# Altium schematic sheet 4-POWER.SchDoc
size A3
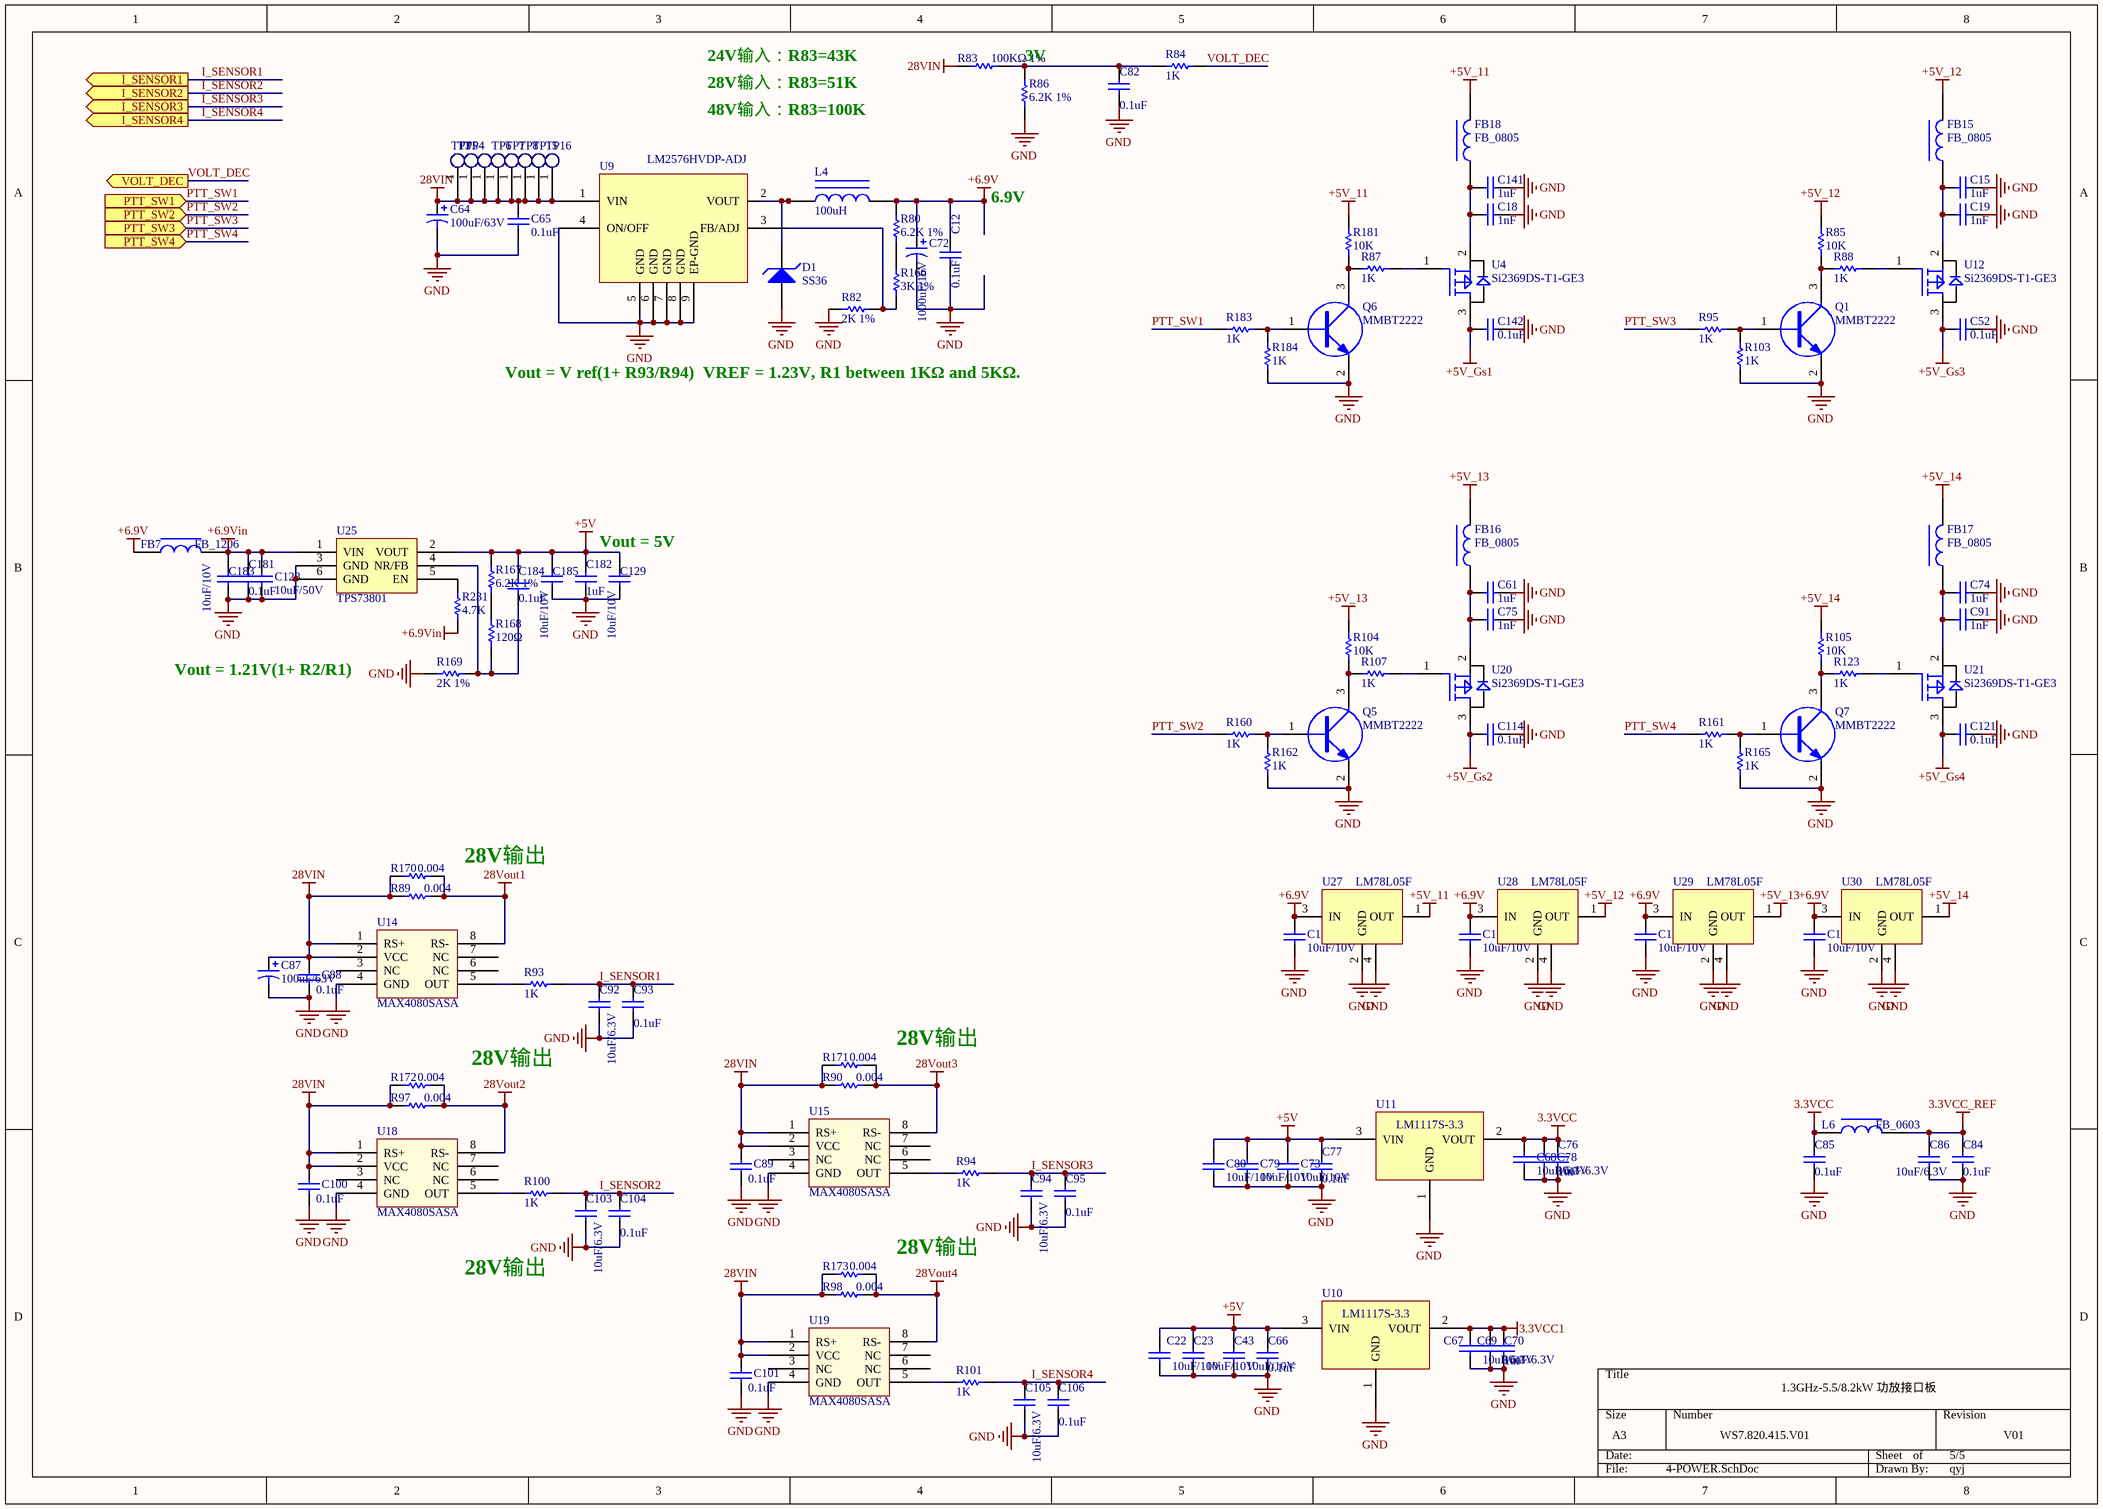
[diagram p0: 4-POWER.SchDoc]

## Parts
C12  0.1uF  [C0603]
C15  1uF  [C0603]
C18  1nF  [C0603]
C19  1nF  [C0603]
C22  10uF/10V  [C0805]
C23  10uF/10V  [C0805]
C43  10uF/10V  [C0805]
C52  0.1uF  [C0603]
C61  1uF  [C0603]
C64  100uF/63V  [ECAP2SM_10R4x10R4]
C65  0.1uF  [C0603]
C66  0.1uF  [C0603]
C67  10uF/6.3V  [C0603]
C68  10uF/6.3V  [C0603]
C69  10uF/6.3V  [C0603]
C70  1uF  [C0603]
C72  1000uF/16V  [ECAP2SM_10R4x10R4]
C73  10uF/10V  [C0805]
C74  1uF  [C0603]
C75  1nF  [C0603]
C76  1uF  [C0603]
C77  0.1uF  [C0603]
C78  10uF/6.3V  [C0603]
C79  10uF/10V  [C0805]
C80  10uF/10V  [C0805]
C82  0.1uF  [C0603]
C84  0.1uF  [C0603]
C85  0.1uF  [C0603]
C86  10uF/6.3V  [C0603]
C87  100uF/63V  [ECAP2SM_10R4x10R4]
C88  0.1uF  [C0603]
C89  0.1uF  [C0603]
C91  1nF  [C0603]
C92  10uF/6.3V  [C0603]
C93  0.1uF  [C0603]
C94  10uF/6.3V  [C0603]
C95  0.1uF  [C0603]
C100  0.1uF  [C0603]
C101  0.1uF  [C0603]
C103  10uF/6.3V  [C0603]
C104  0.1uF  [C0603]
C105  10uF/6.3V  [C0603]
C106  0.1uF  [C0603]
C114  0.1uF  [C0603]
C121  0.1uF  [C0603]
C128  10uF/50V  [C1210]
C129  10uF/10V  [C0805]
C132  10uF/10V  [C0805]
C133  10uF/10V  [C0805]
C134  10uF/10V  [C0805]
C135  10uF/10V  [C0805]
C141  1uF  [C0603]
C142  0.1uF  [C0603]
C181  0.1uF  [C0603]
C182  1uF  [C0603]
C183  10uF/10V  [C0805]
C184  0.1uF  [C0603]
C185  10uF/10V  [C0805]
D1  SS36  [DO-214AC]
FB7  FB_1206  [L1206]
FB15  FB_0805  [L0805]
FB16  FB_0805  [L0805]
FB17  FB_0805  [L0805]
FB18  FB_0805  [L0805]
L4  100uH  [PL2SM-12R5x12R5]
L6  FB_0603  [L0603]
Q1  MMBT2222  [SOT23-3]
Q5  MMBT2222  [SOT23-3]
Q6  MMBT2222  [SOT23-3]
Q7  MMBT2222  [SOT23-3]
R80  6.2K 1%  [R0603]
R82  2K 1%  [R0603]
R83  100KΩ 1%  [R0603]
R84  1K  [R0603]
R85  10K  [R0603]
R86  6.2K 1%  [R0603]
R87  1K  [R0603]
R88  1K  [R0603]
R89  0.004  [R2512]
R90  0.004  [R2512]
R93  1K  [R0603]
R94  1K  [R0603]
R95  1K  [R0603]
R97  0.004  [R2512]
R98  0.004  [R2512]
R100  1K  [R0603]
R101  1K  [R0603]
R103  1K  [R0603]
R104  10K  [R0603]
R105  10K  [R0603]
R107  1K  [R0603]
R123  1K  [R0603]
R160  1K  [R0603]
R161  1K  [R0603]
R162  1K  [R0603]
R165  1K  [R0603]
R166  3K 1%  [R0603]
R167  6.2K 1%  [R0603]
R168  120Ω  [R0603]
R169  2K 1%  [R0603]
R170  0.004  [R2512]
R171  0.004  [R2512]
R172  0.004  [R2512]
R173  0.004  [R2512]
R181  10K  [R0603]
R183  1K  [R0603]
R184  1K  [R0603]
R231  4.7K  [R0603]
TP3  RTF-76-006-M4-S  [FC-M4]  (value not drawn)  (no BOM)
TP4  RTF-76-006-M4-S  [FC-M4]  (value not drawn)  (no BOM)
TP5  RTF-76-006-M4-S  [FC-M4]  (value not drawn)  (no BOM)
TP6  RTF-76-006-M4-S  [FC-M4]  (value not drawn)  (no BOM)
TP7  RTF-76-006-M4-S  [FC-M4]  (value not drawn)  (no BOM)
TP8  RTF-76-006-M4-S  [FC-M4]  (value not drawn)  (no BOM)
TP15  RTF-76-006-M4-S  [FC-M4]  (value not drawn)  (no BOM)
TP16  RTF-76-006-M4-S  [FC-M4]  (value not drawn)  (no BOM)
U4  Si2369DS-T1-GE3  [SOT23-3]
U9  LM2576HVDP-ADJ  [SOIC8_1R27_3R9x4R9-1]
U10  LM1117S-3.3  [SOT-223]
U11  LM1117S-3.3  [SOT-223]
U12  Si2369DS-T1-GE3  [SOT23-3]
U14  MAX4080SASA  [SOIC8_1R27_3R9x4R9]
U15  MAX4080SASA  [SOIC8_1R27_3R9x4R9]
U18  MAX4080SASA  [SOIC8_1R27_3R9x4R9]
U19  MAX4080SASA  [SOIC8_1R27_3R9x4R9]
U20  Si2369DS-T1-GE3  [SOT23-3]
U21  Si2369DS-T1-GE3  [SOT23-3]
U25  TPS73801  [SOT-223-6]
U27  LM78L05F  [SOT-89]
U28  LM78L05F  [SOT-89]
U29  LM78L05F  [SOT-89]
U30  LM78L05F  [SOT-89]

## Ports
I_SENSOR1 (out), I_SENSOR2 (out), I_SENSOR3 (out), I_SENSOR4 (out), PTT_SW1 (in), PTT_SW2 (in), PTT_SW3 (in), PTT_SW4 (in), VOLT_DEC (out)

## Nets
3.3VCC: C68.2 C76.2 C78.2 C85.2 L6.1 U11.2(VOUT)
3.3VCC1: C67.2 C69.2 C70.2 U10.2(VOUT)
3.3VCC_REF: C84.2 C86.2 L6.2
28VIN: C64.1 C65.2 C87.1 C88.2 C89.2 C100.2 C101.2 R83.1 R89.1 R90.1 R97.1 R98.1 R170.1 R171.1 R172.1 R173.1 TP3.1(TP) TP4.1(TP) TP5.1(TP) TP6.1(TP) TP7.1(TP) TP8.1(TP) TP15.1(TP) TP16.1(TP) U9.1(VIN) U14.1(RS+) U14.2(VCC) U15.1(RS+) U15.2(VCC) U18.1(RS+) U18.2(VCC) U19.1(RS+) U19.2(VCC)
28Vout1: R89.2 R170.2 U14.8(RS-)
28Vout2: R97.2 R172.2 U18.8(RS-)
28Vout3: R90.2 R171.2 U15.8(RS-)
28Vout4: R98.2 R173.2 U19.8(RS-)
+5V: C22.2 C23.2 C43.2 C66.2 C73.2 C77.2 C79.2 C80.2 C129.2 C182.2 C184.2 C185.2 R167.2 U10.3(VIN) U11.3(VIN) U25.2(VOUT)
+5V_11: FB18.2 R181.2 U27.1(OUT)
+5V_12: FB15.2 R85.2 U28.1(OUT)
+5V_13: FB16.2 R104.2 U29.1(OUT)
+5V_14: FB17.2 R105.2 U30.1(OUT)
+5V_Gs1: C142.2 U4.3(D)
+5V_Gs2: C114.2 U20.3(D)
+5V_Gs3: C52.2 U12.3(D)
+5V_Gs4: C121.2 U21.3(D)
+6.9V: C12.2 C72.1 C132.2 C133.2 C134.2 C135.2 FB7.1 L4.2 R80.2 U27.3(IN) U28.3(IN) U29.3(IN) U30.3(IN)
+6.9Vin: C128.2 C181.2 C183.2 FB7.2 R231.2 U25.1(VIN)
GND: C12.1 C15.1 C18.2 C19.2 C22.1 C23.1 C43.1 C52.1 C61.1 C64.2 C65.1 C66.1 C67.1 C68.1 C69.1 C70.1 C72.2 C73.1 C74.1 C75.2 C76.1 C77.1 C78.1 C79.1 C80.1 C82.1 C84.1 C85.1 C86.1 C87.2 C88.1 C89.1 C91.2 C92.1 C93.1 C94.1 C95.1 C100.1 C101.1 C103.1 C104.1 C105.1 C106.1 C114.1 C121.1 C128.1 C129.1 C132.1 C133.1 C134.1 C135.1 C141.1 C142.1 C181.1 C182.1 C183.1 C185.1 D1.1(A) Q1.2(E) Q5.2(E) Q6.2(E) Q7.2(E) R82.2 R86.1 R103.1 R162.1 R165.1 R169.2 R184.1 U9.4(ON/OFF) U9.5(GND) U9.6(GND) U9.7(GND) U9.8(GND) U9.9(EP-GND) U10.1(GND) U11.1(GND) U14.4(GND) U15.4(GND) U18.4(GND) U19.4(GND) U25.3(GND) U25.6(GND) U27.2(GND) U27.4(GND) U28.2(GND) U28.4(GND) U29.2(GND) U29.4(GND) U30.2(GND) U30.4(GND)
I_SENSOR1: C92.2 C93.2 R93.2 ; port I_SENSOR1
I_SENSOR2: C103.2 C104.2 R100.2 ; port I_SENSOR2
I_SENSOR3: C94.2 C95.2 R94.2 ; port I_SENSOR3
I_SENSOR4: C105.2 C106.2 R101.2 ; port I_SENSOR4
PTT_SW1: R183.1 ; port PTT_SW1
PTT_SW2: R160.1 ; port PTT_SW2
PTT_SW3: R95.1 ; port PTT_SW3
PTT_SW4: R161.1 ; port PTT_SW4
VOLT_DEC: R84.1 ; port VOLT_DEC
NetC15_2: C15.2 C19.1 FB15.1 U12.2(S)
NetC18_1: C18.1 C141.2 FB18.1 U4.2(S)
NetC61_2: C61.2 C75.1 FB16.1 U20.2(S)
NetC74_2: C74.2 C91.1 FB17.1 U21.2(S)
NetC82_2: C82.2 R83.2 R84.2 R86.2
NetC184_1: C184.1 R168.1 R169.1 U25.4(NR/FB)
NetD1_2: D1.2(K) L4.1 U9.2(VOUT)
NetQ1_1: Q1.1(B) R95.2 R103.2
NetQ1_3: Q1.3(C) R85.1 R88.1
NetQ5_1: Q5.1(B) R160.2 R162.2
NetQ5_3: Q5.3(C) R104.1 R107.1
NetQ6_1: Q6.1(B) R183.2 R184.2
NetQ6_3: Q6.3(C) R87.1 R181.1
NetQ7_1: Q7.1(B) R161.2 R165.2
NetQ7_3: Q7.3(C) R105.1 R123.1
NetR80_1: R80.1 R166.2
NetR82_1: R82.1 R166.1 U9.3(FB/ADJ)
NetR87_2: R87.2 U4.1(G)
NetR88_2: R88.2 U12.1(G)
NetR93_1: R93.1 U14.5(OUT)
NetR94_1: R94.1 U15.5(OUT)
NetR100_1: R100.1 U18.5(OUT)
NetR101_1: R101.1 U19.5(OUT)
NetR107_2: R107.2 U20.1(G)
NetR123_2: R123.2 U21.1(G)
NetR167_1: R167.1 R168.2
NetR231_1: R231.1 U25.5(EN)

Not connected (* = marked no-connect by the designer): U14 3(NC) 6(NC) 7(NC); U15 3(NC) 6(NC) 7(NC); U18 3(NC) 6(NC) 7(NC); U19 3(NC) 6(NC) 7(NC)

## Notes on the sheet
- 24V输入：R83=43K
- 28V输入：R83=51K
- (near R86) 3V
- 48V输入：R83=100K
- 6.9V
- Vout = V ref(1+ R93/R94)  VREF = 1.23V, R1 between 1KΩ and 5KΩ.
- Vout = 5V
- Vout = 1.21V(1+ R2/R1)
- 28V输出
- 1.3GHz-5.5/8.2kW 功放接口板
- WS7.820.415.V01
- 5/5
- V01
- qyj

## Library data of the parts
C12 C52 C65 C66 C77 C82 C84 C85 C88 C89 C93 C95 C100 C101 C104 C106 C114 C121 C142 C181 C184 = 0.1uF贴片电容: 贴片电容_GRM188R71H104KA01D_0.1uF±10%,50V,0603; code: 01010045
C15 C61 C70 C74 C76 C141 C182 = 1uF贴片电容: 贴片电容_GRM188R61A105KA61D_1uF±10%,10V,0603; code: 01010038
C18 C19 C75 C91 = 1000pF贴片电容: 贴片电容_GRM188R71H102KA01_1000pF±10%,50V,0603; code: 01010093
C22 C23 C43 C73 C79 C80 C129 C132-C135 C183 C185 = 10uF贴片电容: 贴片电容_GRM21BR61A106KE19L_10uF±10%,10V,0805; code: 01010036
C64 C87 = 100uF/63V: 贴片电解电容_VEJ101M1JTR-1010_100uF/63V,±20%,表贴D10*H10; code: 01080002
C67-C69 C78 C86 C92 C94 C103 C105 = 10uF贴片电容: 贴片电容_GRM188R60J106ME47D_10uF±20%,6.3V,0603; code: 01010037
C72 = 1000uF/16V: 贴片电解电容_VE102M1CTR-1010_1000uF/16V,±20%,表贴10*10; code: 01080003
C128 = 10uF贴片电容: 贴片电容_GRM32ER71H106KA12L_10uF±10%,50V,1210; code: 03030021
D1 = 肖特基整流二极管_SS36: 肖特基整流二极管_SS36_封装SMA,3A/60V; code: 01040003
FB7 = 1206贴片磁珠: 贴片磁珠_30R,6A,1206; code: 0103015
FB15-FB18 = 0805贴片磁珠: 贴片磁珠_600R,0805; code: 01030023
L4 = 100uH贴片功率电感: 贴片功率电感_SLF12575T-101M1R9-PF_100uH±20%,额定电流1.9A,12.5x12.5; code: 01030003
L6 = 0603贴片磁珠: 贴片磁珠_100R,0603; code: 0103016
Q1 Q5-Q7 = MMBT2222: NPN三极管_MMBT2222_表贴SOT23; code: 01050001
R80 R167 = 6.2K贴片电阻: 贴片电阻_6.2K±5%,0603; code: 01020106
R82 R169 = 2K贴片电阻: 贴片电阻_2K±5%,0603; code: 01020086
R83 = 12.4K贴片电阻: 贴片电阻_12.4K±1%,0603; code: 01020125
R84 R87 R88 R93-R95 R100 R101 R103 R107 R123 R160-R162 R165 R183 R184 = 1K贴片电阻: 贴片电阻_1K±5%,0603; code: 01020082
R85 R104 R105 R181 = 10K贴片电阻: 贴片电阻_10K±5%,0603; code: 01020011
R86 = 1.5K贴片电阻: 贴片电阻_1.5K±5%,0603; code: 01020063
R89 R90 R97 R98 R170-R173 = 0.004Ω检流电阻-标准封装: 贴片电阻_LR12DTDSR004_0.004±5%,2W,2512; code: 01020105
R166 = 3K贴片电阻: 贴片电阻_3K±5%,0603; code: 01020065
R168 = 120Ω贴片电阻: 贴片电阻_120Ω±5%,0603; code: 01020112
R231 = 4.7K贴片电阻: 贴片电阻_4.7K±5%,0603; code: 01020012
TP3-TP8 TP15 TP16 = TP2mm: 表贴测试点1mm
U4 U12 U20 U21 = Si2369DS-T1-GE3: P-MOS_Si2369DS-T1-GE3_SOT23; code: 01060087
U9 = LM2576HVDP-ADJ: 稳压集成电路_LM2576HVDP-ADJ_3A输出,SOIC8; code: 03020005; Maker: HTC
U10 U11 = LM1117S-3.3: LDO_LM1117S-3.3_1A输出,SOT223; code: 01060031
U14 U15 U18 U19 = MAX4080TASA: 电流检测放大器_MAX4080SASA_SOIC8; Maker: MAXIM; code: 01060160
U25 = TPS73701DCQ: LDO_TPS73801_1A输出,SOT223-6; Maker: TI; code: 01060111
U27-U30 = LM78L05F: 功率放大器_LM78L05F_5V输出,100mA输出,SOT89; Maker: HTC; code: 03020026